# Altium schematic sheet HSYNC.SchDoc: HSYNC
size A4; SheetNumber: 2
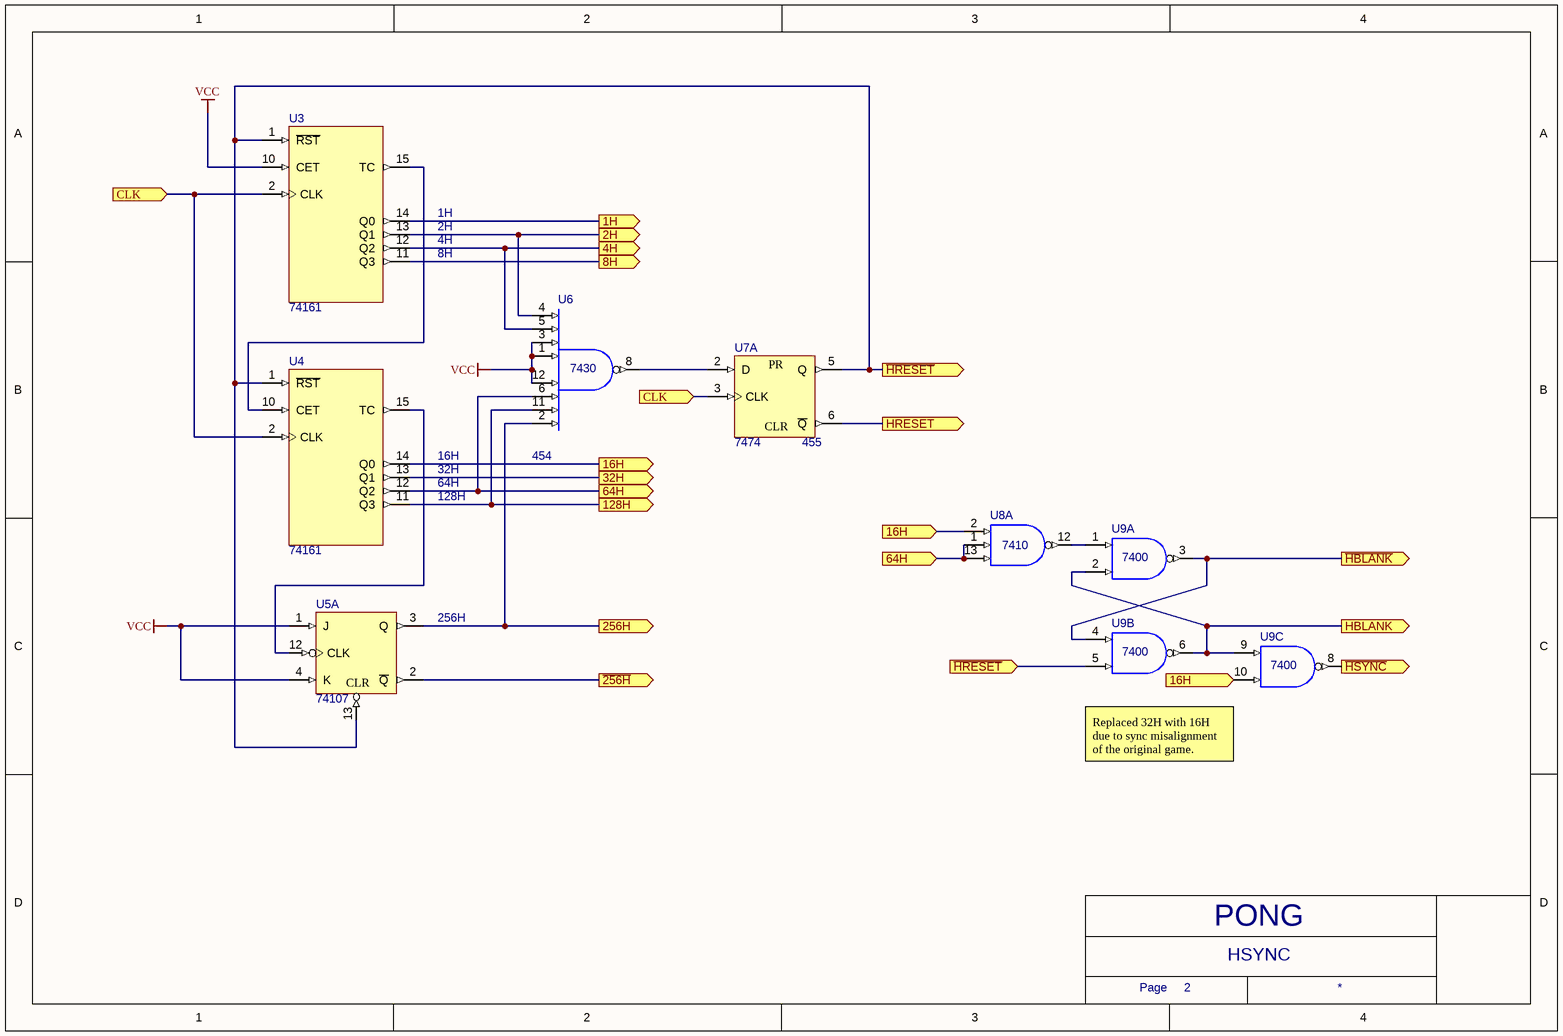
[diagram p0: HSYNC.SchDoc]

## Parts
U3  74161  [N016]
U4  74161  [N016]
U5  74107  [N014]  (part A of 2)
U6  7430  [N014]
U7  7474  [N014D]  (part A of 2)
U8  7410  [N014]  (part A of 3)
U9  7400  [N014]  (parts A,B,C of 4)

## Ports
1H, 2H, 4H, 8H, 16H, 32H, 64H, 128H, 256H, CLK, HBLANK, HRESET, ~{256H}, ~{HBLANK}, ~{HRESET}, ~{HSYNC}

## Nets
GND: U3.8(GND) U4.8(GND) U5.7(GND) U6.7(GND) U7.7(GND) U8.7(GND) U9.7(GND)
VCC: U3.3(P0) U3.4(P1) U3.5(P2) U3.6(P3) U3.7(CEP) U3.9(~{PE}) U3.10(CET) U3.16(VCC) U4.3(P0) U4.4(P1) U4.5(P2) U4.6(P3) U4.7(CEP) U4.9(~{PE}) U4.16(VCC) U5.1(J) U5.4(K) U5.14(VCC) U6.1(A) U6.3(C) U6.12(H) U6.14(VCC) U7.1(CLR) U7.4(PR) U7.14(VCC) U8.14(VCC) U9.14(VCC)
1H: U3.14(Q0) ; port 1H
2H: U3.13(Q1) U6.4(D) ; port 2H
4H: U3.12(Q2) U6.5(E) ; port 4H
8H: U3.11(Q3) ; port 8H
16H: U4.14(Q0) U8.2(B) U9.10(B) ; port 16H
32H: U4.13(Q1) ; port 32H
64H: U4.12(Q2) U6.6(F) U8.1(A) U8.13(C) ; port 64H
128H: U4.11(Q3) U6.11(G) ; port 128H
256H: U5.3(Q) U6.2(B) ; port 256H
~{256H}: U5.2(~{Q}) ; port ~{256H}
~{HBLANK}: U9.3(Y) U9.4(A) ; port ~{HBLANK}
~{HRESET}: U3.1(~{RST}) U4.1(~{RST}) U5.13(CLR) U7.5(Q) U9.5(B) ; port ~{HRESET}
~{HSYNC}: U9.8(Y) ; port ~{HSYNC}
CLK: U3.2(CLK) U4.2(CLK) U7.3(CLK) ; port CLK
HBLANK: U9.2(B) U9.6(Y) U9.9(A) ; port HBLANK
HRESET: U7.6(~{Q}) ; port HRESET
NetU3_15: U3.15(TC) U4.10(CET)
NetU4_15: U4.15(TC) U5.12(CLK)
NetU6_8: U6.8(Y) U7.2(D)
NetU8_12: U8.12(Y) U9.1(A)

## Notes on the sheet
- 1H
- 2H
- 4H
- 8H
- (near U7) 455
- 16H
- 32H
- 64H
- 128H
- (near U6) 454
- (near U5) 256H
- (near U9) Replaced 32H with 16H due to sync misalignment of the original game.
- Text
- Page
- PONG

## Library data of the parts
U3 U4 = SN74LS161AN: Synchronous 4-Bit Counter; Published: 8-Jun-2000; LatestRevisionDate: 04-Mar-2005; LatestRevisionNote: Stylized 3D Model Added.; DatasheetVersion: Mar-1988; PackageVersion: Oct-1995; PackageReference: N016; Publisher: Altium Limited; PackageDescription: DIP; 16 Leads; Row Spacing 7.62 mm; Pitch 2.54 mm; Code_JEDEC: MS-001-BB; ComponentLink1Description: Manufacturer Link; ComponentLink1URL: http://www.ti.com/; ComponentLink2Description: Datasheet; ComponentLink2URL: http://www-s.ti.com/sc/ds/sn74ls161a.pdf; ComponentLink3Description: URL Link1; ComponentLink3URL: http://focus.ti.com/docs/prod/folders/print/sn74ls161a.html
U5 = SN74LS107AN: Dual J-K Flip-Flop with Clear; Published: 8-Jun-2000; LatestRevisionDate: 04-Mar-2005; LatestRevisionNote: Stylized 3D Model Added.; DatasheetVersion: Mar-1988; PackageVersion: Oct-1995; PackageReference: N014; Publisher: Altium Limited; PackageDescription: DIP; 14 Leads; Row Spacing 7.62 mm; Pitch 2.54 mm; ComponentLink1Description: Manufacturer Link; ComponentLink1URL: http://www.ti.com/; ComponentLink2Description: Datasheet; ComponentLink2URL: http://www-s.ti.com/sc/ds/sn74ls107a.pdf
U6 = SN74LS30N: 8-Input Positive-NAND Gate; Note: Pins 9, 10  and 13 are NC & not drawn.; Published: 8-Jun-2000; LatestRevisionDate: 04-Mar-2005; LatestRevisionNote: Stylized 3D Model Added.; DatasheetVersion: Mar-1988; PackageVersion: Oct-1995; PackageReference: N014; Publisher: Altium Limited; PackageDescription: DIP; 14 Leads; Row Spacing 7.62 mm; Pitch 2.54 mm; ComponentLink1Description: Manufacturer Link; ComponentLink1URL: http://www.ti.com/; ComponentLink2Description: Datasheet; ComponentLink2URL: http://www-s.ti.com/sc/ds/sn74s30.pdf
U7 = SN74LS74AN: Dual D-Type Positive-Edge-Triggered Flip-Flop with Preset and Clear; Published: 8-Jun-2000; LatestRevisionDate: 04-Mar-2005; LatestRevisionNote: Stylized 3D Model Added.; DatasheetVersion: Mar-1988; PackageVersion: Oct-1995; PackageReference: N014D; Publisher: Altium Limited; PackageDescription: DIP; 14 Leads; Row Spacing 7.62 mm; Pitch 2.54 mm; ComponentLink1Description: Manufacturer Link; ComponentLink1URL: http://www.ti.com/; ComponentLink2Description: Datasheet; ComponentLink2URL: http://www-s.ti.com/sc/ds/sn74ls74a.pdf
U8 = SN74LS10N: Triple 3-Input Positive-NAND Gate; Published: 8-Jun-2000; LatestRevisionDate: 04-Mar-2005; LatestRevisionNote: Stylized 3D Model Added.; DatasheetVersion: Mar-1988; PackageVersion: Oct-1995; PackageReference: N014; Publisher: Altium Limited; PackageDescription: DIP; 14 Leads; Row Spacing 7.62 mm; Pitch 2.54 mm; ComponentLink1Description: Manufacturer Link; ComponentLink1URL: http://www.ti.com/; ComponentLink2Description: Datasheet; ComponentLink2URL: http://www-s.ti.com/sc/ds/sn74ls10.pdf
U9 = SN74LS00N: Quadruple 2-Input Positive-NAND Gate; Published: 8-Jun-2000; LatestRevisionDate: 04-Mar-2005; LatestRevisionNote: Stylized 3D Model Added.; DatasheetVersion: Mar-1988; PackageVersion: Oct-1995; PackageReference: N014; Publisher: Altium Limited; PackageDescription: DIP; 14 Leads; Row Spacing 7.62 mm; Pitch 2.54 mm; ComponentLink1Description: Manufacturer Link; ComponentLink1URL: http://www.ti.com/; ComponentLink2Description: Datasheet; ComponentLink2URL: http://www-s.ti.com/sc/ds/sn74ls00.pdf